# EasyEDA Pro project ProPrj_SRC_Robot2025_V1.0_2026-09-06.epro, schematic Schematic-ENCODER
Board Name: Encoder; Create Date: 2025-08-08; Page Name: P1; Project Name: SRC_Robot2025_V1.0; Schematic Name: Schematic-ENCODER; Update Date: 2025-08-08; Company: 嘉立创EDA; Page Size: A4; Version: V1.0
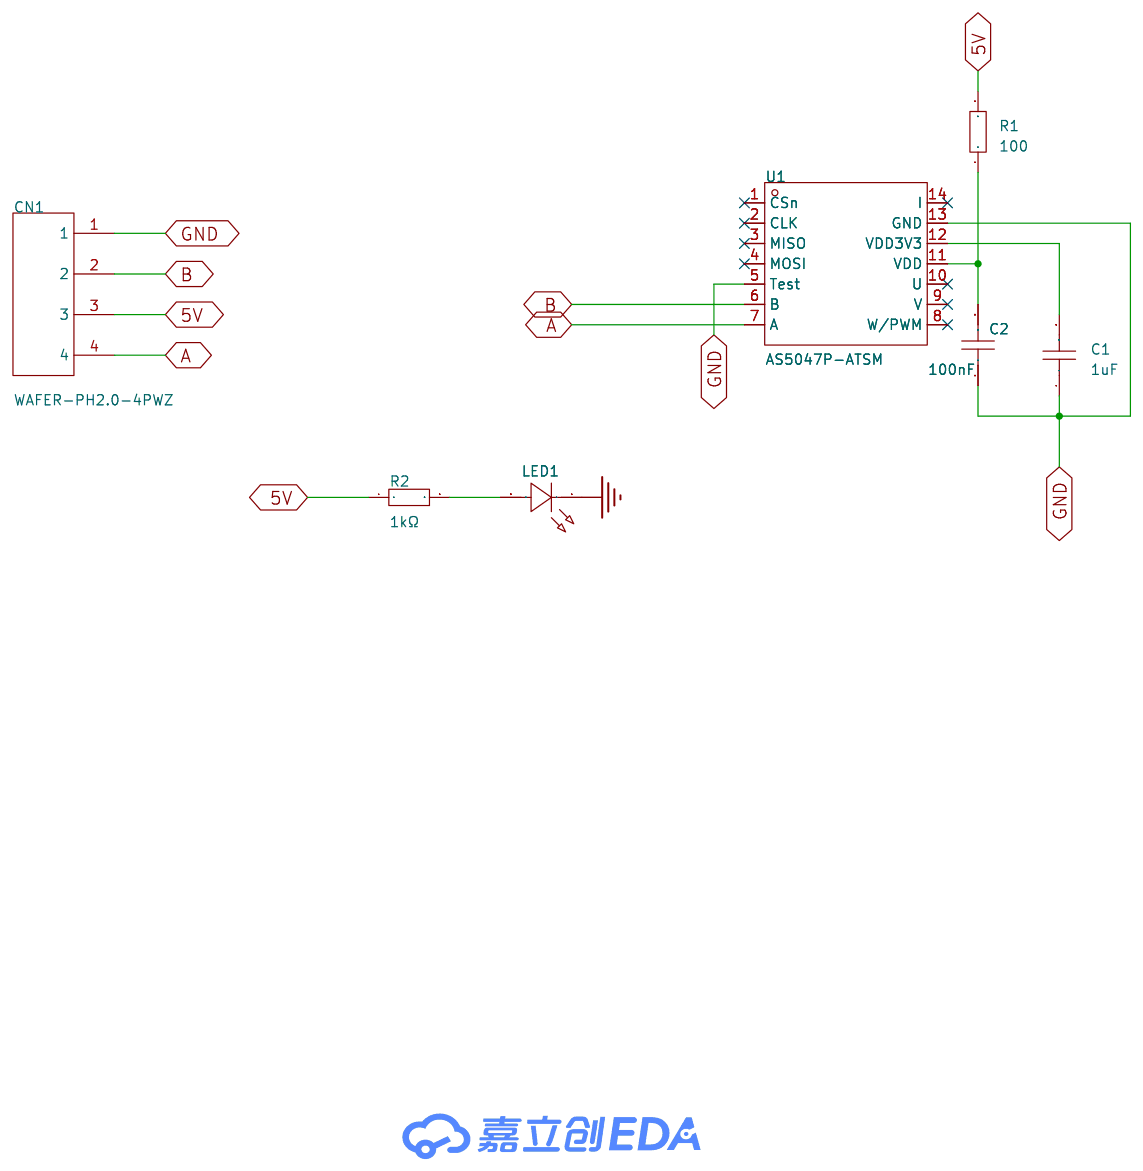
[diagram p3: schematic sheet]

## Parts
C1  1uF  [C0603]
C2  100nF  [C0603]
CN1  WAFER-PH2.0-4PWZ  [CONN-TH_4P-P2.00_BX-PH2.0-4PWZ]
LED1  A-SP192GW1D-D01-4T  [LED0603-RD]
R1  100  [R0603]
R2  1kΩ  [R0603]
U1  AS5047P-ATSM  [TSSOP-14_L5.0-W4.4-P0.65-LS6.4-BL]

## Library data of the parts
C1 C2 = CGA0603X5R105K500JT: 容值:1uF;精度:±10%;额定电压:50V;温度系数:X5R;; LCSC Part Name: 1uF ±10% 50V; Supplier Part: C6119852; Manufacturer: HRE(芯声); Supplier Footprint: 0603; JLCPCB Part Class: 扩展库; Supplier: LCSC; Tolerance: ±10%; Voltage Rating: 50V; Temperature Coefficient: X5R
CN1 = WAFER-PH2.0-4PWZ: 插针结构:1x4P;间距:2mm;安装方式:弯插;参考系列:PH;总PIN数:4P;排数:1;每排PIN数:4;行距:-;额定电流:2A;触头材质:黄铜;触头镀层:锡;工作温度:-25℃~+85℃;; LCSC Part Name: 1x4P 间距:2mm 弯插 系列:PH; Supplier Part: C5359612; Manufacturer: XUNPU(讯普); Supplier Footprint: 弯插,P=2mm; JLCPCB Part Class: Extended Part; Datasheet: https://atta.szlcsc.com/upload/public/pdf/source/20230728/47B07572F36CD4F6F91BE29B817CECA3.pdf; Supplier: LCSC; Pins Structure: 1x4P; Pitch: 2mm; Mounting Type: 弯插; Reference Series: PH; Number of Pins: 4P; Number of Rows: 1; Number of PINs Per Row: 4; Current Rating: 2A; Contact Material: 黄铜; Contact Plating: 锡; Operating Temperature: -25℃~+85℃; Voltage Rating: 250V; Plastic Material: PA66; Flame Retardant Rating: UL94V-0; Color: 白色; Z-Height of the Board: 4.7mm; X-Length of Bottom Edge on Board (Spacing Line): 10mm; Y-Width of Bottom Edge on Board: 6.05mm
LED1 = A-SP192GW1D-D01-4T: 发光颜色:白色;正向压降(Vf):2.5V~2.9V;功率:95mW;透镜颜色:-;发光强度:57mcd~225mcd;发光角度:130°;载带方式:正贴;工作温度:-40℃~+85℃;; LCSC Part Name: 0603白光正贴（正白偏冷）; Supplier Part: C19171285; Manufacturer: Amicc(欧密格光电); Supplier Footprint: 0603; JLCPCB Part Class: 扩展库; Datasheet: https://atta.szlcsc.com/upload/public/pdf/source/20231108/C509B7BEC9EA0B1CC79F1E6D714E882A.pdf; Supplier: LCSC; Illumination Color: 白色; Voltage - Forward(Vf): 2.5V~2.9V; Power(Watts): 95mW; Luminous Intensity: 57mcd~225mcd; Viewing Angle: 130°; Mounting Sytle: 正贴; Operating Temperature: -40℃~+85℃
R1 = Res_0603: Supplier Footprint: 0603
R2 = 0603WAF1001T5E: 电阻类型:厚膜电阻;阻值:1kΩ;精度:±1%;功率:100mW;最大工作电压:75V;温度系数:±100ppm/℃;; LCSC Part Name: 1kΩ ±1% 100mW 厚膜电阻; Supplier Part: C21190; Manufacturer: UNI-ROYAL(厚声); Supplier Footprint: 0603; JLCPCB Part Class: 基础库; Datasheet: https://atta.szlcsc.com/upload/public/pdf/source/20200306/C422600_1E6D84923E4A46A82E41ADD87F860B5C.pdf; Supplier: LCSC; Type: 厚膜电阻; Tolerance: ±1%; Power(Watts): 100mW; Overload Voltage (Max): 75V; Temperature Coefficient: ±100ppm/℃; Operating Temperature Range: -55℃~+155℃
U1 = AS5047P-ATSM_C962063: Supplier Part: C962063; Manufacturer: ams(艾迈斯半导体); Supplier Footprint: TSSOP-14; JLCPCB Part Class: 扩展库; Datasheet: https://atta.szlcsc.com/upload/public/pdf/source/20230424/95EDFD761CCFD379FE860E4B35935AF0.pdf; Supplier: LCSC

## Nets
5V: CN1.3 R1.2 R2.1
GND: C1.1 C2.1 CN1.1 LED1.1(K) U1.5(Test) U1.13(GND)
A: CN1.4 U1.7(A)
B: CN1.2 U1.6(B)
$1N352: C1.2 U1.12(VDD3V3)
$1N359: C2.2 R1.1 U1.11(VDD)
$1N651: LED1.2(A) R2.2

Not connected (* = marked no-connect by the designer): U1 1(CSn)* 2(CLK)* 3(MISO)* 4(MOSI)* 8(W/PWM)* 9(V)* 10(U)* 14(I)*
